# Altium project flight_ComputerPCB.PrjPcb
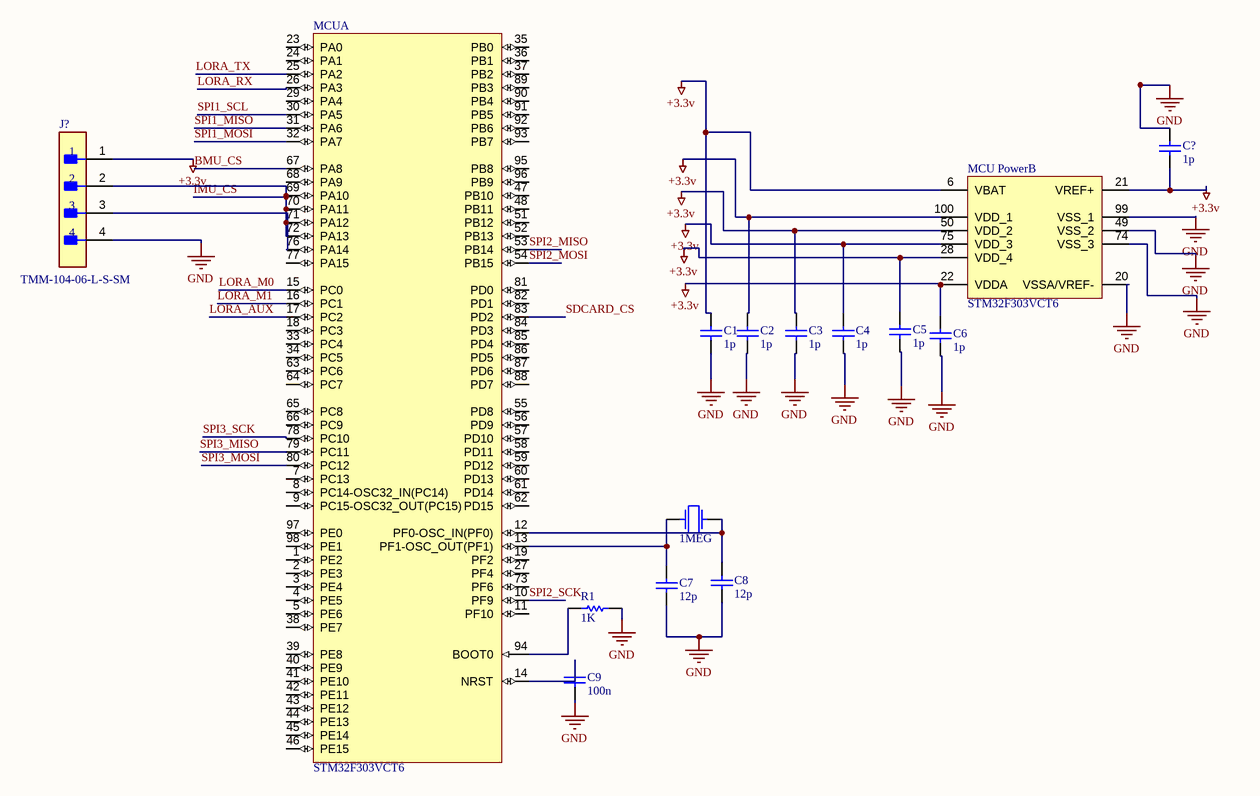
[diagram p0: MCU.SchDoc]
3 sheets, 31 parts. Net scope: global (net labels, ports and power ports of the same name join across sheets).
Sheets:
  MCU.SchDoc
  power.SchDoc
  Sensors.SchDoc

## Sheet MCU.SchDoc
size 431 x 279 mm; SheetNumber: 1; SheetTotal: 4

### Parts
?  F0: 1MEG  (hidden comment: Crystal)
C1  value 1p  (hidden comment: Capacitor)
C2  value 1p  (hidden comment: Capacitor)
C3  value 1p  (hidden comment: Capacitor)
C4  value 1p  (hidden comment: Capacitor)
C5  value 1p  (hidden comment: Capacitor)
C6  C6: 1p  (hidden comment: Capacitor)
C7  value 12p  (hidden comment: Capacitor)
C8  C8: 12p  (hidden comment: Capacitor)
C9  value 100n  (hidden comment: Capacitor)
C?  C6: 1p  (hidden comment: Capacitor)
J?  TMM-104-06-L-S-SM  [FP-TMM-104-06-L-S-SM-MFG]
MCU  STM32F303VCT6  [STM-LQFP100_L]  (part A of 2)
MCU_Power  STM32F303VCT6  [STM-LQFP100_L]  (part B of 2)
R1  value 1K  (hidden comment: Resistor)

### Nets
+3.3v: C1.2 C2.2 C3.2 C4.2 C5.2 C6.2 C?.1 J?.1 MCU_Power.6(VBAT) MCU_Power.21(VREF+) MCU_Power.22(VDDA) MCU_Power.28(VDD_4) MCU_Power.50(VDD_2) MCU_Power.75(VDD_3) MCU_Power.100(VDD_1)
GND: C1.1 C2.1 C3.1 C4.1 C5.1 C6.1 C7.1 C8.1 C9.1 C?.2 J?.4 MCU_Power.20(VSSA/VREF-) MCU_Power.49(VSS_2) MCU_Power.74(VSS_3) MCU_Power.99(VSS_1) R1.2
BMU_CS: MCU.67(PA8)
IMU_CS: J?.2 MCU.69(PA10) MCU.70(PA11) MCU.71(PA12) MCU.72(PA13)
LORA_AUX: MCU.17(PC2)
LORA_M0: MCU.15(PC0)
LORA_M1: MCU.16(PC1)
LORA_RX: MCU.26(PA3)
LORA_TX: MCU.25(PA2)
SDCARD_CS: MCU.83(PD2)
SPI1_MISO: MCU.31(PA6)
SPI1_MOSI: MCU.32(PA7)
SPI1_SCL: MCU.30(PA5)
SPI2_MISO: MCU.53(PB14)
SPI2_MOSI: MCU.54(PB15)
SPI2_SCK: MCU.10(PF9)
SPI3_MISO: MCU.79(PC11)
SPI3_MOSI: MCU.80(PC12)
SPI3_SCK: MCU.78(PC10)
Net?_1: ?.1 C7.2 MCU.13(PF1-OSC_OUT(PF1))
Net?_2: ?.2 C8.2 MCU.12(PF0-OSC_IN(PF0))
NetC9_2: C9.2 MCU.14(NRST)
NetJ?_3: J?.3 MCU.76(PA14)
NetMCU_94: MCU.94(BOOT0) R1.1

Not connected (* = marked no-connect by the designer): MCU 1(PE2) 2(PE3) 3(PE4) 4(PE5) 5(PE6) 7(PC13) 8(PC14-OSC32_IN(PC14)) 9(PC15-OSC32_OUT(PC15)) 11(PF10) 18(PC3) 19(PF2) 23(PA0) 24(PA1) 27(PF4) 29(PA4) 33(PC4) 34(PC5) 35(PB0) 36(PB1) 37(PB2) 38(PE7) 39(PE8) 40(PE9) 41(PE10) 42(PE11) 43(PE12) 44(PE13) 45(PE14) 46(PE15) 47(PB10) 48(PB11) 51(PB12) 52(PB13) 55(PD8) 56(PD9) 57(PD10) 58(PD11) 59(PD12) 60(PD13) 61(PD14) 62(PD15) 63(PC6) 64(PC7) 65(PC8) 66(PC9) 68(PA9) 73(PF6) 77(PA15) 81(PD0) 82(PD1) 84(PD3) 85(PD4) 86(PD5) 87(PD6) 88(PD7) 89(PB3) 90(PB4) 91(PB5) 92(PB6) 93(PB7) 95(PB8) 96(PB9) 97(PE0) 98(PE1)

### Notes on the sheet
- DWG. NO.
- REV.
- SHT.
- THIS DOCUMENT AND THE DATA DISCLOSED HEREIN OR HEREWITH IS THE PROPERTY OF ALTIUM LIMITED AND MAY BE FREELY DISTRIBUTED IN WHOLE. NO RIGHTS ARE RESERVED OR EXPRESS OR IMPLIED WARANTEE GIVEN.
- REVISION
- DESCRIPTION
- DATE
- APPROVED
- ENG:
- APPROVALS
- PROJECT
- DSN:
- CHK:
- REFERENCE DOCUMENTS
- PROJECT REVISION:
- TITLE
- DOCUMENT REVISION:
- DESIGN ITEM:
- BOM:
- FAB DWG:
- PCB DWG:
- ASSY DWG:
- SCALE:
- SIZE
- B
- CAGE CODE
- FILE NAME
- DWG NO.
- SHEET
- OF
- REV

### Library data of the parts
? = Crystal: R: 500; Q: 50K; SimulationGenericComponent: True
C1-C9 C? = Capacitor: SimulationGenericComponent: True
J? = CMP-02766-001580-1: 2MM TERMINAL STRIP; Connector Type: Header; Max Current Rating: 3.9A; Number of Positions: 4; Gender: Male; Max Voltage Rating (AC): 500V; Contact Type: Male Pin; Flammability Rating: UL94 V-0; Length: 8mm; Housing Material: Polymer; Contact Finish - Mating: GOLD; Fastening Type: Pull; Max Operating Temperature: 125°C; Contact Shape: Square; Number of Contacts: 4; Series: TMM; Pitch: 2mm; Orientation: Straight; RoHS Compliant: Yes; Lead Free: Lead Free; Contact Material: Bronze; Termination: Solder; Insulation Color: Black; Min Operating Temperature: -55°C; Insulation Material: Polymer; Housing Color: Black; Number of Rows: 1; Packaging: Rail/Tube; Depth: 1.97mm; Contact Plating: Gold; Radiation Hardening: No
MCU MCU_Power = CMP-0572-00009-2: ARM Cortex-M4 32-bit MCU, 256 KB Flash, 40 KB Internal RAM, 87 I/Os, 100-pin LQFP, -40 to 85 degC, Tray; Internal RAM Size (kB): 40; FLASH Size (Prog) (kB): 256; Supply Voltage(Vcc) min (V): 2; I/Os (High Current): 87; Operating Frequency(F) (Processor speed) (MHz): 72; D/A Converter: 2x12-bit (2 Channel); ComponentLink2URL: http://www.st.com/st-web-ui/static/active/en/resource/technical/document/datasheet/DM00058181.pdf; PackageVersion: Rev. 1, 06/2013; ComponentLink2Description: Datasheet; DatasheetVersion: Rev. 6; Packing: Tray; ComponentLink3Description: Package Specification; Mounting Technology: Surface Mount; PackageReference: LQFP100; ComponentLink1URL: http://www.st.com/web/en/home.html; ComponentLink3URL: http://www.st.com/st-web-ui/static/active/en/resource/technical/document/data_brief/DM00071938.pdf; PackageDescription: 100-Pin Low Profile Quad Flat Package, 14 x 14 mm Body, 0.5 mm Pitch; ComponentLink1Description: Manufacturer URL; PartNumber: STM32F303VCT6; Core: ARM Cortex-M4
R1 = Resistor: TC1: 0; SimulationGenericComponent: True; TC2: 0

## Sheet power.SchDoc
size A; SheetNumber: 2; SheetTotal: 2
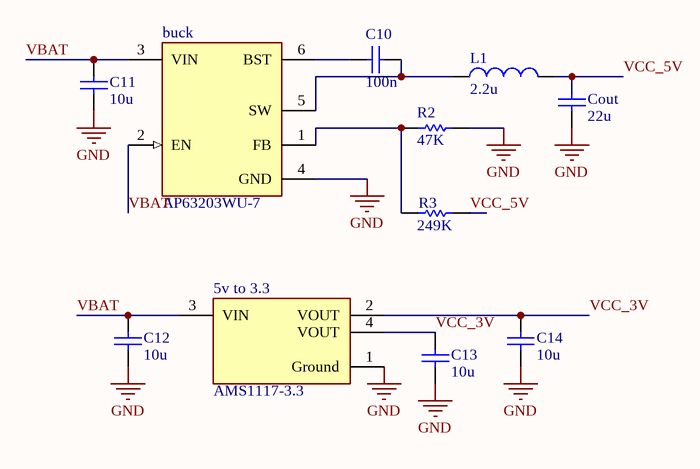
[diagram p1: power.SchDoc]

### Parts
5v_to_3.3  AMS1117-3.3  [FP-AMS1117-IPC_C]
buck  AP63203WU-7  [FP-TSOT26-MFG]
C10  value 100n  (hidden comment: Capacitor)
C11  value 10u  (hidden comment: Capacitor)
C12  value 10u  (hidden comment: Capacitor)
C13  value 10u  (hidden comment: Capacitor)
C14  value 10u  (hidden comment: Capacitor)
Cout  value 22u  (hidden comment: Capacitor)
L1  value 2.2u  (hidden comment: Inductor)
R2  value 47K  (hidden comment: Resistor)
R3  value 249K  (hidden comment: Resistor)

### Nets
GND: 5v_to_3.3.1(Ground) buck.4(GND) C11.2 C12.2 C13.2 C14.2 Cout.1 R2.2
VBAT: 5v_to_3.3.3(VIN) buck.2(EN) buck.3(VIN) C11.1 C12.1
VCC_3V: 5v_to_3.3.2(VOUT) 5v_to_3.3.4(VOUT) C13.1 C14.1
VCC_5V: Cout.2 L1.2 R3.2
Netbuck_1: buck.1(FB) R2.1 R3.1
Netbuck_5: buck.5(SW) C10.2 L1.1
Netbuck_6: buck.6(BST) C10.1

### Library data of the parts
5v_to_3.3 = CMP-209535-000001-1: LDO Voltage Regulators 1A, 3.3V; Manufacturer: Advanced Monolithic Systems; Dropout Voltage: 1.1V; Output Type: Fixed; Nominal Supply Current: 5mA; Max Power Dissipation: 1.2W; Max Supply Voltage: 15V; Number Of Outputs: 1; Standoff Height: 0.64mm; Max Junction Temp: +125°C; Height: 1.8mm; Package: AMS1117; Device Class L2: Power Management ICs; ComponentLink2Description: Datasheet; ComponentLink2URL: http://www.advanced-monolithic.com/pdf/ds1117.pdf; Category: IC; RoHS: TRUE; Automotive: No; Device Class L1: Integrated Circuits (ICs); Output Current: 1A; Device Class L3: Voltage Regulators - Linear; Temperature: -40°C to +125°C; Output Voltage: 3.3V; Manufacturer Part Number: AMS1117-3.3; Temperature Range Low: -40°C; Octopart: https://octopart.com/ams1117-3.3-advanced+monolithic+systems-25899300; Lead Free: Yes; Ipc Land Pattern Name: SOT229P700X180-4; Temperature Range High: +125°C
buck = CMP-12757-000006-1: IC REG BUCK 3.3V 2A TSOT26; Manufacturer: Diodes Inc.; Description: Buck Switching Regulator IC Positive Fixed 3.3V 1 Output 2A SOT-23-6 Thin, TSOT-23-6; Output Type: Fixed; Min Supply Voltage: 3.8V; Number Of Outputs: 1; Max Junction Temp: +160°C; Nominal Supply Current: 22uA; Standoff Height: 0.01mm; Switching Frequency: 1.1MHz; Max Supply Voltage: 32V; ComponentLink2Description: Datasheet; Device Class L1: Integrated Circuits (ICs); Temperature: to +160°C; Device Class L3: Voltage Regulators - Switching; RoHS: TRUE; Octopart: https://octopart.com/ap63203wu-7-diodes+inc.-98099550; Output Voltage: 3.3V; Lead Free: Yes; ComponentLink2URL: https://www.diodes.com/assets/Datasheets/AP63200-AP63201-AP63203-AP63205.pdf; Digikey Description: IC REG BUCK 3.3V 2A TSOT26; Footprint Url: https://www.diodes.com/assets/Package-Files/TSOT26.pdf; Ambient Temperature Range High: +85°C; Height: 1mm; Automotive: No; Temperature Range High: +160°C; Switching Topology: Buck; Output Current: 2A; Package: TSOT26; Category: IC; Mouser Description: AP63203 Series 3.3 V 2 A SMT Fixed Low IQ Synchronous Buck - TSOT-26; Device Class L2: Power Management ICs; Ambient Temperature Range Low: -40°C; Manufacturer Part Number: AP63203WU-7
C10-C14 Cout = Capacitor: SimulationGenericComponent: True
L1 = Inductor: SimulationGenericComponent: True
R2 R3 = Resistor: TC1: 0; SimulationGenericComponent: True; TC2: 0

## Sheet Sensors.SchDoc
size A; SheetNumber: 3; SheetTotal: 4
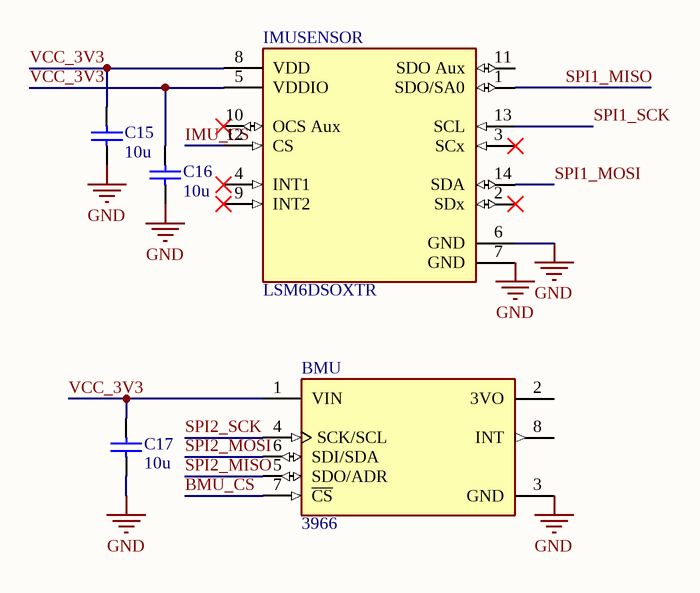
[diagram p2: Sensors.SchDoc]

### Parts
BMU  3966  [FP-3966-MFG]
C15  value 10u  (hidden comment: Capacitor)
C16  value 10u  (hidden comment: Capacitor)
C17  value 10u  (hidden comment: Capacitor)
IMUSENSOR  LSM6DSOXTR  [FP-LGA-14L-DM00249496-MFG]

### Nets
GND: BMU.3(GND) C15.1 C16.1 C17.1 IMUSENSOR.6(GND) IMUSENSOR.7(GND)
BMU_CS: BMU.7(~{CS})
IMU_CS: IMUSENSOR.12(CS)
SPI1_MISO: IMUSENSOR.1(SDO/SA0)
SPI1_MOSI: IMUSENSOR.14(SDA)
SPI1_SCK: IMUSENSOR.13(SCL)
SPI2_MISO: BMU.5(SDO/ADR)
SPI2_MOSI: BMU.6(SDI/SDA)
SPI2_SCK: BMU.4(SCK/SCL)
VCC_3V3: BMU.1(VIN) C15.2 C16.2 C17.2 IMUSENSOR.5(VDDIO) IMUSENSOR.8(VDD)

Not connected (* = marked no-connect by the designer): BMU 2(3VO) 8(INT); IMUSENSOR 2(SDx)* 3(SCx)* 4(INT1)* 9(INT2)* 10(OCS_Aux)* 11(SDO_Aux)

### Library data of the parts
BMU = CMP-144239-000001-1: BMP388 - PRECISION BAROMETRIC PR
C15-C17 = Capacitor: SimulationGenericComponent: True
IMUSENSOR = CMP-12177-000010-1: INEMO INERTIAL MODULE: 3D ACCELE; Manufacturer: STMicroelectronics; Sensor Type: Temperature,Accelerometer,Gyroscope; Accel Range: 2/4/8/16g; Accel Sensitivity: 0.061/0.122/0.244/0.488mV/g; Operating Supply Current: 0.55mA; Gyro Range: 125/250/500/1000/2000°/s; Gyro Sensitivity: 4.375/8.75/17.5/35/70LSB/°/s; Sensor Output: I2C,SPI,Other; Min Supply Voltage: 1.62V; Max Supply Voltage: 3.6V; Description: Accelerometer, Gyroscope, 6 Axis Sensor I²C, SPI Output; Octopart: https://octopart.com/lsm6dsoxtr-stmicroelectronics-98102600; Package: LGA-14L-DM00249496; Footprint Url: https://www.st.com/content/ccc/resource/technical/document/technical_note/73/17/9c/16/dd/96/4a/01/CD00134799.pdf/files/CD00134799.pdf/jcr:content/translations/en.CD00134799.pdf; ComponentLink2Description: Datasheet; Mouser Description: LSM6DSOX: 3.6 V 3 Axis Accelerometer Gyroscope iNEMO Inertial Module - LGA-14L; ComponentLink2URL: https://www.st.com/resource/en/datasheet/lsm6dsox.pdf; Temperature Range Low: -40°C; Digikey Description: INEMO INERTIAL MODULE: 3D ACCELE; Lead Free: Yes; Device Class L3: Inertial Measurement Units (IMUs); Category: IC; Device Class L2: Motion Sensors; RoHS: TRUE; Temperature: -40°C to +85°C; Height: 0.86mm; Device Class L1: Sensors; Temperature Range High: +85°C; Manufacturer Part Number: LSM6DSOXTR; Automotive: No

## Nets that join several sheets
GND: MCU (16 pins), power (8 pins), Sensors (6 pins)
BMU_CS: MCU (MCU.67), Sensors (BMU.7)
IMU_CS: MCU (5 pins), Sensors (IMUSENSOR.12)
SPI1_MISO: MCU (MCU.31), Sensors (IMUSENSOR.1)
SPI1_MOSI: MCU (MCU.32), Sensors (IMUSENSOR.14)
SPI2_MISO: MCU (MCU.53), Sensors (BMU.5)
SPI2_MOSI: MCU (MCU.54), Sensors (BMU.6)
SPI2_SCK: MCU (MCU.10), Sensors (BMU.4)